# EAGLE design dual-mux (EAGLE 6.5.0)
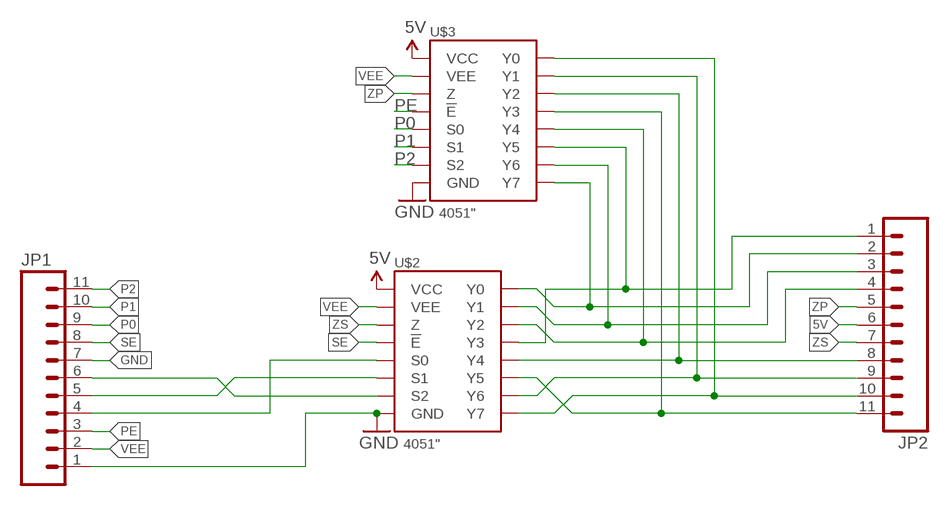
[diagram p0: schematic, sheet 1]

## Parts
JP1  M11LONGPADS  [1X11_LONGPADS]
JP2  M11LONGPADS  [1X11_LONGPADS]
U$2  4051"  [TSSOP-16]
U$3  4051"  [TSSOP-16]

## Nets
5V: JP2.6 U$2.P$16(VCC) U$3.P$16(VCC)
GND: JP1.1 JP1.7 U$2.P$8(GND) U$3.P$8(GND)
N$6: JP2.4 U$2.P$15(Y2) U$3.P$1(Y4)
N$7: JP2.10 U$2.P$4(Y7) U$3.P$13(Y0)
N$8: JP2.8 U$2.P$1(Y4) U$3.P$15(Y2)
N$9: JP2.11 U$2.P$5(Y5) U$3.P$12(Y3)
N$10: JP2.1 U$2.P$12(Y3) U$3.P$5(Y5)
N$11: JP2.2 U$2.P$13(Y0) U$3.P$4(Y7)
N$12: JP2.3 U$2.P$14(Y1) U$3.P$2(Y6)
N$13: JP2.9 U$2.P$2(Y6) U$3.P$14(Y1)
P0: JP1.9 U$3.P$11(S0)
P1: JP1.10 U$3.P$10(S1)
P2: JP1.11 U$3.P$9(S2)
PE: JP1.3 U$3.P$6(!E)
S0: JP1.4 U$2.P$11(S0)
S1: JP1.5 U$2.P$10(S1)
S2: JP1.6 U$2.P$9(S2)
SE: JP1.8 U$2.P$6(!E)
VEE: JP1.2 U$2.P$7(VEE) U$3.P$7(VEE)
ZP: JP2.5 U$3.P$3(Z)
ZS: JP2.7 U$2.P$3(Z)

## Library data of the parts
JP1 JP2 = SparkFun-Connectors:M11: Header 11 Standard 11-pin 0.1" header. Use with straight break away headers (SKU : PRT-00116), right angle break away headers (PRT-00553), swiss pins (PRT-00743), machine pins (PRT-00117), and female headers (PRT-00115).
U$2 U$3 = butter:4051: 74HC4051PW NXP 8:1 Analog Multiplexer digikey <http://www.digikey.com/product-detail/en/74HC4051PW,118/568-2259-1-ND/946721>

## Board
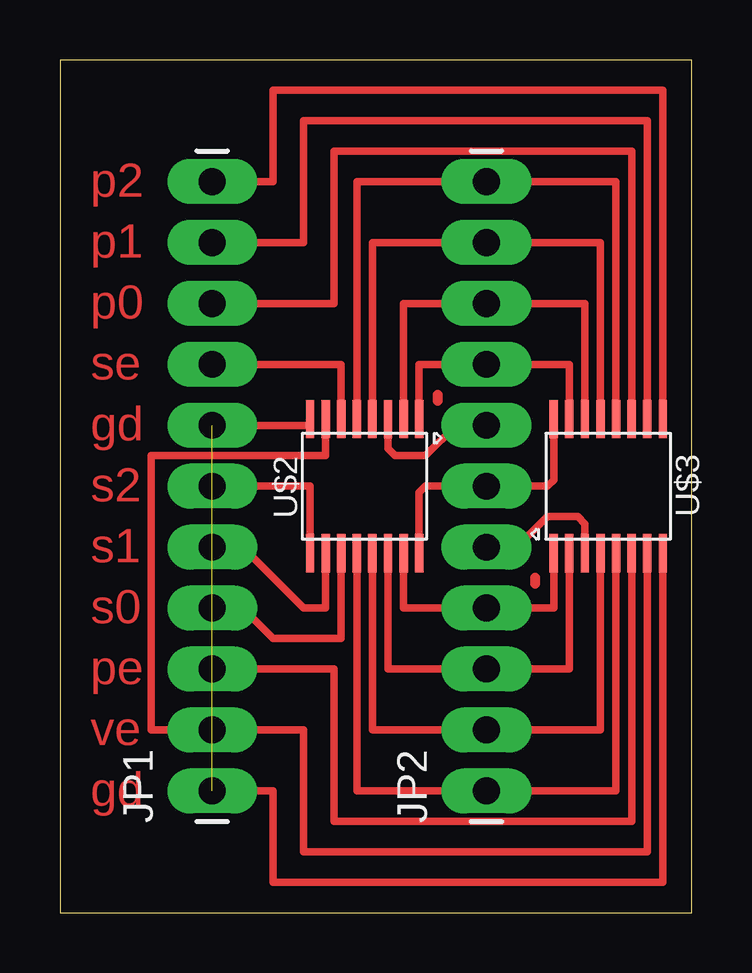
[diagram p1: board, top side]

Size 26.34 x 35.55 mm. Coordinates in mm from the lower left corner, seen from the top.
Outline: 0,0 26.34,0 26.34,35.55 0,35.55 0,0
Copper layers (1*16): Top 0.035mm / dielectric 1.5mm / Bottom 0.035mm
Design rules "default": minimum track width 10mil, minimum drill 24mil, track to track 8mil, track to pad 8mil, pad to pad 8mil, via to via 8mil, smd to smd 8mil, copper to edge 40mil, drill to drill 8mil, minimum pad ring 10mil, minimum via ring 8mil, stop-mask expansion 4mil, vias tented up to drill 0mil, thermal gap 10mil

### Footprints (pad centres in the part's own frame; a part is rotated, then mirrored left to right if it is on the bottom)
1X11_LONGPADS = drill 1.118 pad 1.88 long: 1 0,0; 2 2.54,0; 3 5.08,0; 4 7.62,0; 5 10.16,0; 6 12.7,0; 7 15.24,0; 8 17.78,0; 9 20.32,0; 10 22.86,0; 11 25.4,0
TSSOP-16 = smd 1.6 x 0.35: P$1 -2.8,2.275; P$2 -2.8,1.625; P$3 -2.8,0.975; P$4 -2.8,0.325; P$5 -2.8,-0.325; P$6 -2.8,-0.975; P$7 -2.8,-1.625; P$8 -2.8,-2.275; P$9 2.8,-2.275; P$10 2.8,-1.625; P$11 2.8,-0.975; P$12 2.8,-0.325; P$13 2.8,0.325; P$14 2.8,0.975; P$15 2.8,1.625; P$16 2.8,2.275

### Placement (x,y rotation side)
JP1  6.35,5.08 90 top
JP2  17.78,5.08 90 top
U$2  12.7,17.78 270 top
U$3  22.86,17.78 90 top

### Tracks (layer width: path | path; a pad name or v marks a point on that pad's centre or on a via)
5V
  Top 0.305: U$2.P$16 14.97,17.52 15.24,17.78 JP2.6 20.32,17.78 20.59,18.05 U$3.P$16
GND  (1 unrouted)
  Top 0.305: U$3.P$8 25.14,1.27 8.89,1.27 8.89,5.08 JP1.1 | JP1.7 10.43,20.32 U$2.P$8
N$1
  Top 0.406: 19.81,13.97 19.81,13.72
N$2
  Top 0.406: 15.75,21.59 15.75,21.34
N$6
  Top 0.305: U$3.P$1 20.59,12.7 JP2.4 14.32,12.7 U$2.P$15
N$7
  Top 0.305: U$3.P$13 22.54,27.94 JP2.10 13.03,27.94 U$2.P$4
N$8
  Top 0.305: U$3.P$15 21.23,22.86 JP2.8 14.97,22.86 U$2.P$1
N$9
  Top 0.305: U$2.P$5 12.38,30.48 JP2.11 23.18,30.48 U$3.P$12
N$10
  Top 0.305: 12.38,8.89 U$2.P$12 12.38,5.08 JP2.1 23.18,5.08 U$3.P$5 23.18,8.89
N$11
  Top 0.305: U$3.P$4 22.54,7.62 JP2.2 13.03,7.62 U$2.P$13
N$12
  Top 0.305: U$3.P$2 21.23,10.16 JP2.3 13.68,10.16 U$2.P$14
N$13
  Top 0.305: U$3.P$14 21.89,25.4 JP2.9 14.32,25.4 U$2.P$2
P0
  Top 0.305: JP1.9 11.43,25.4 11.43,31.75 23.84,31.75 U$3.P$11
P1
  Top 0.305: JP1.10 10.16,27.94 10.16,33.02 24.48,33.02 U$3.P$10
P2
  Top 0.305: JP1.11 8.89,30.48 8.89,34.29 25.14,34.29 U$3.P$9
PE
  Top 0.305: U$3.P$6 23.84,3.81 11.43,3.81 11.43,10.16 JP1.3
S0
  Top 0.305: U$2.P$11 11.72,11.43 8.89,11.43 7.62,12.7 JP1.4
S1
  Top 0.305: U$2.P$10 11.07,12.7 10.16,12.7 7.62,15.24 JP1.5
S2
  Top 0.305: U$2.P$9 10.43,17.78 JP1.6
SE
  Top 0.305: JP1.8 11.72,22.86 U$2.P$6
VEE
  Top 0.305: U$3.P$7 24.48,2.54 10.16,2.54 10.16,7.62 JP1.2 3.81,7.62 3.81,19.05 11.07,19.05 U$2.P$7
ZP
  Top 0.305: U$3.P$3 21.89,16.21 21.59,16.51 20.32,16.51 19.05,15.24 JP2.5
ZS
  Top 0.305: U$2.P$3 13.68,19.34 13.97,19.05 15.24,19.05 16.51,20.32 JP2.7

### Text on the board
Top: p2 | p1 | p0 | se | gd | s2 | s1 | s0 | pe | ve | gd